# EasyEDA Pro project ProPrj_zmk-afa_2025-04-29.epro

# Schematic Schematic1
Board Name: Board1; Create Date: 2025-04-28; Page Name: P1; Project Name: zmk-afa; Schematic Name: Schematic1; Update Date: 2025-04-28; Company: 嘉立创EDA; Page Size: A4; Version: V1.0
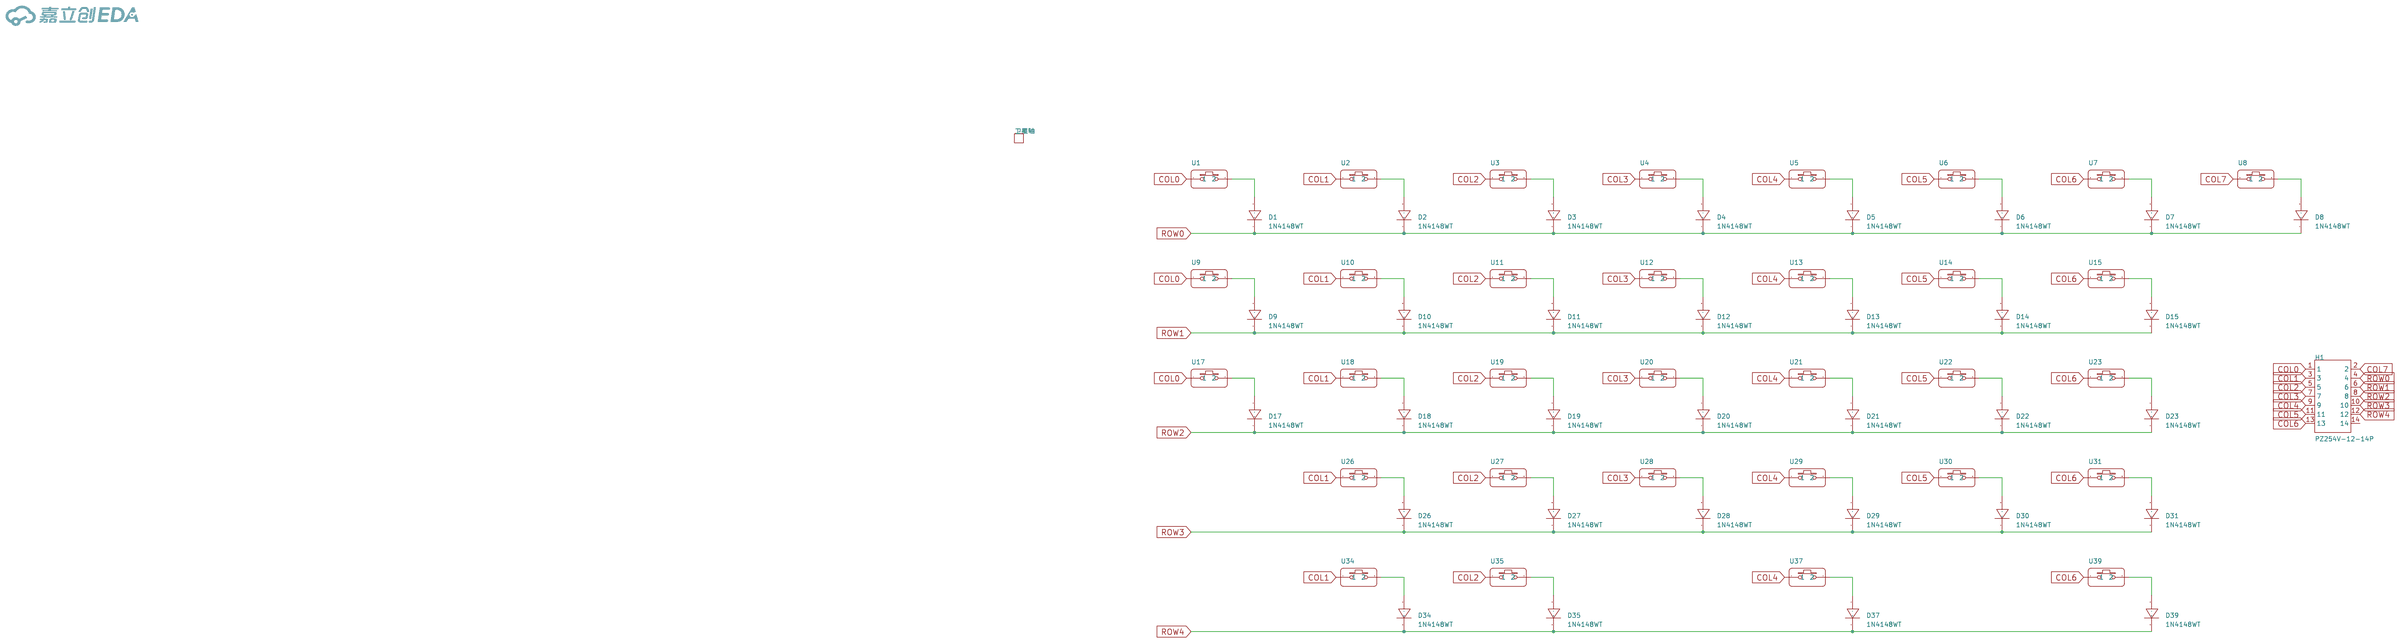
[diagram p0: schematic sheet]

## Parts
D1  1N4148WT  [SOD-123_L2.8-W1.8-LS3.7-RD-3]
D2  1N4148WT  [SOD-123_L2.8-W1.8-LS3.7-RD-3]
D3  1N4148WT  [SOD-123_L2.8-W1.8-LS3.7-RD-3]
D4  1N4148WT  [SOD-123_L2.8-W1.8-LS3.7-RD-3]
D5  1N4148WT  [SOD-123_L2.8-W1.8-LS3.7-RD-3]
D6  1N4148WT  [SOD-123_L2.8-W1.8-LS3.7-RD-3]
D7  1N4148WT  [SOD-123_L2.8-W1.8-LS3.7-RD-3]
D8  1N4148WT  [SOD-123_L2.8-W1.8-LS3.7-RD-3]
D9  1N4148WT  [SOD-123_L2.8-W1.8-LS3.7-RD-3]
D10  1N4148WT  [SOD-123_L2.8-W1.8-LS3.7-RD-3]
D11  1N4148WT  [SOD-123_L2.8-W1.8-LS3.7-RD-3]
D12  1N4148WT  [SOD-123_L2.8-W1.8-LS3.7-RD-3]
D13  1N4148WT  [SOD-123_L2.8-W1.8-LS3.7-RD-3]
D14  1N4148WT  [SOD-123_L2.8-W1.8-LS3.7-RD-3]
D15  1N4148WT  [SOD-123_L2.8-W1.8-LS3.7-RD-3]
D17  1N4148WT  [SOD-123_L2.8-W1.8-LS3.7-RD-3]
D18  1N4148WT  [SOD-123_L2.8-W1.8-LS3.7-RD-3]
D19  1N4148WT  [SOD-123_L2.8-W1.8-LS3.7-RD-3]
D20  1N4148WT  [SOD-123_L2.8-W1.8-LS3.7-RD-3]
D21  1N4148WT  [SOD-123_L2.8-W1.8-LS3.7-RD-3]
D22  1N4148WT  [SOD-123_L2.8-W1.8-LS3.7-RD-3]
D23  1N4148WT  [SOD-123_L2.8-W1.8-LS3.7-RD-3]
D26  1N4148WT  [SOD-123_L2.8-W1.8-LS3.7-RD-3]
D27  1N4148WT  [SOD-123_L2.8-W1.8-LS3.7-RD-3]
D28  1N4148WT  [SOD-123_L2.8-W1.8-LS3.7-RD-3]
D29  1N4148WT  [SOD-123_L2.8-W1.8-LS3.7-RD-3]
D30  1N4148WT  [SOD-123_L2.8-W1.8-LS3.7-RD-3]
D31  1N4148WT  [SOD-123_L2.8-W1.8-LS3.7-RD-3]
D34  1N4148WT  [SOD-123_L2.8-W1.8-LS3.7-RD-3]
D35  1N4148WT  [SOD-123_L2.8-W1.8-LS3.7-RD-3]
D37  1N4148WT  [SOD-123_L2.8-W1.8-LS3.7-RD-3]
D39  1N4148WT  [SOD-123_L2.8-W1.8-LS3.7-RD-3]
H1  PZ254V-12-14P  [HDR-TH_14P-P2.54-V-M-R2-C7-S2.54]
U1  -  [两用轴座无灯]
U2  -  [两用轴座无灯]
U3  -  [两用轴座无灯]
U4  -  [两用轴座无灯]
U5  -  [两用轴座无灯]
U6  -  [两用轴座无灯]
U7  -  [两用轴座无灯]
U8  -  [两用轴座无灯]
U9  -  [两用轴座无灯]
U10  -  [两用轴座无灯]
U11  -  [两用轴座无灯]
U12  -  [两用轴座无灯]
U13  -  [两用轴座无灯]
U14  -  [两用轴座无灯]
U15  -  [两用轴座无灯]
U17  -  [两用轴座无灯]
U18  -  [两用轴座无灯]
U19  -  [两用轴座无灯]
U20  -  [两用轴座无灯]
U21  -  [两用轴座无灯]
U22  -  [两用轴座无灯]
U23  -  [两用轴座无灯]
U26  -  [两用轴座无灯]
U27  -  [两用轴座无灯]
U28  -  [两用轴座无灯]
U29  -  [两用轴座无灯]
U30  -  [两用轴座无灯]
U31  -  [两用轴座无灯]
U34  -  [两用轴座无灯]
U35  -  [两用轴座无灯]
U37  -  [两用轴座无灯]
U39  -  [两用轴座无灯]
卫星轴  -  [卫星轴]

## Library data of the parts
D1-D15 D17-D23 D26-D31 D34 D35 D37 D39 = 1N4148WT_C232841: 二极管配置:独立式;正向压降(Vf):1V@10mA;直流反向耐压(Vr):75V;整流电流:300mA;反向恢复时间(trr):4ns;; LCSC Part Name: 电压:75V 电流:300mA; Supplier Part: C232841; Manufacturer: onsemi(安森美); Supplier Footprint: SOD-523F; JLCPCB Part Class: 扩展库; Datasheet: https://atta.szlcsc.com/upload/public/pdf/source/20181222/C232841_42C5BA49E5A441BB8F6B91D0F4CD0D51.pdf; Supplier: LCSC; Diode Configuration: 独立式; Forward Voltage (Vf@If): 1V@10mA; Reverse Voltage (Vr): 75V; Rectified Current: 300mA; Reverse Leakage Current: 5uA@75V; Reverse Recovery Time (trr): 4ns; Operating Temperature: -55℃~+150℃@(Tj)
H1 = PZ254V-12-14P: 插针结构:2x7P;间距:2.54mm;行距:2.54mm;圆针/方针:方针;安装方式:直插;排数:双排;总PIN位数:14P;额定电流:-;额定电压:-;配合针长度:6mm;塑高:2.5mm;端接针长度:3mm;触头材质:黄铜;触头镀层:-;工作温度:-40℃~+105℃;颜色:黑色;; LCSC Part Name: 2x7P 间距:2.54mm 方针 直插; Supplier Part: C492424; Manufacturer: XFCN(兴飞); Supplier Footprint: 插件,P=2.54mm; JLCPCB Part Class: 扩展库; Datasheet: https://atta.szlcsc.com/upload/public/pdf/source/20200309/C492424_D71F2B7B4151908BA6AE7E1F567EA536.pdf; Supplier: LCSC; Pin Structure: 2x7P; Pitch: 2.54mm; Row Spacing: 2.54mm; Circluar Pins/Square Pins: 方针; Mounting Type: 直插; Number of Rows: 双排; Number of Pins: 14P; Length of Mating Pin: 6mm; Insulation Height: 2.5mm; Length of End Connection Pin: 3mm; Contact Material: 黄铜; Operating Temperature: -40℃~+105℃; Color: 黑色
U1-U15 U17-U23 U26-U31 U34 U35 U37 U39 = 两用轴座无灯
卫星轴 = 卫星轴: _: 3

## Nets
COL0: H1.1 U1.1 U9.1 U17.1
COL1: H1.3 U2.1 U10.1 U18.1 U26.1 U34.1
COL2: H1.5 U3.1 U11.1 U19.1 U27.1 U35.1
COL3: H1.7 U4.1 U12.1 U20.1 U28.1
COL4: H1.9 U5.1 U13.1 U21.1 U29.1 U37.1
COL5: H1.11 U6.1 U14.1 U22.1 U30.1
COL6: H1.13 U7.1 U15.1 U23.1 U31.1 U39.1
COL7: H1.2 U8.1
ROW0: D1.1(C) D2.1(C) D3.1(C) D4.1(C) D5.1(C) D6.1(C) D7.1(C) D8.1(C) H1.4
ROW1: D9.1(C) D10.1(C) D11.1(C) D12.1(C) D13.1(C) D14.1(C) D15.1(C) H1.6
ROW2: D17.1(C) D18.1(C) D19.1(C) D20.1(C) D21.1(C) D22.1(C) D23.1(C) H1.8
ROW3: D26.1(C) D27.1(C) D28.1(C) D29.1(C) D30.1(C) D31.1(C) H1.10
ROW4: D34.1(C) D35.1(C) D37.1(C) D39.1(C) H1.12
$1N4395: D1.2(A) U1.2
$1N4398: D2.2(A) U2.2
$1N4402: D3.2(A) U3.2
$1N4406: D4.2(A) U4.2
$1N4410: D5.2(A) U5.2
$1N4414: D6.2(A) U6.2
$1N4418: D7.2(A) U7.2
$1N4422: D8.2(A) U8.2
$1N4426: D9.2(A) U9.2
$1N4430: D10.2(A) U10.2
$1N4434: D11.2(A) U11.2
$1N4438: D12.2(A) U12.2
$1N4442: D13.2(A) U13.2
$1N4446: D14.2(A) U14.2
$1N4450: D15.2(A) U15.2
$1N4458: D17.2(A) U17.2
$1N4462: D18.2(A) U18.2
$1N4466: D19.2(A) U19.2
$1N4470: D20.2(A) U20.2
$1N4474: D21.2(A) U21.2
$1N4478: D22.2(A) U22.2
$1N4482: D23.2(A) U23.2
$1N4494: D26.2(A) U26.2
$1N4498: D27.2(A) U27.2
$1N4502: D28.2(A) U28.2
$1N4506: D29.2(A) U29.2
$1N4510: D30.2(A) U30.2
$1N4514: D31.2(A) U31.2
$1N4526: D34.2(A) U34.2
$1N4530: D35.2(A) U35.2
$1N4538: D37.2(A) U37.2
$1N4546: D39.2(A) U39.2

Not connected (* = marked no-connect by the designer): H1 14

# Board PCB1
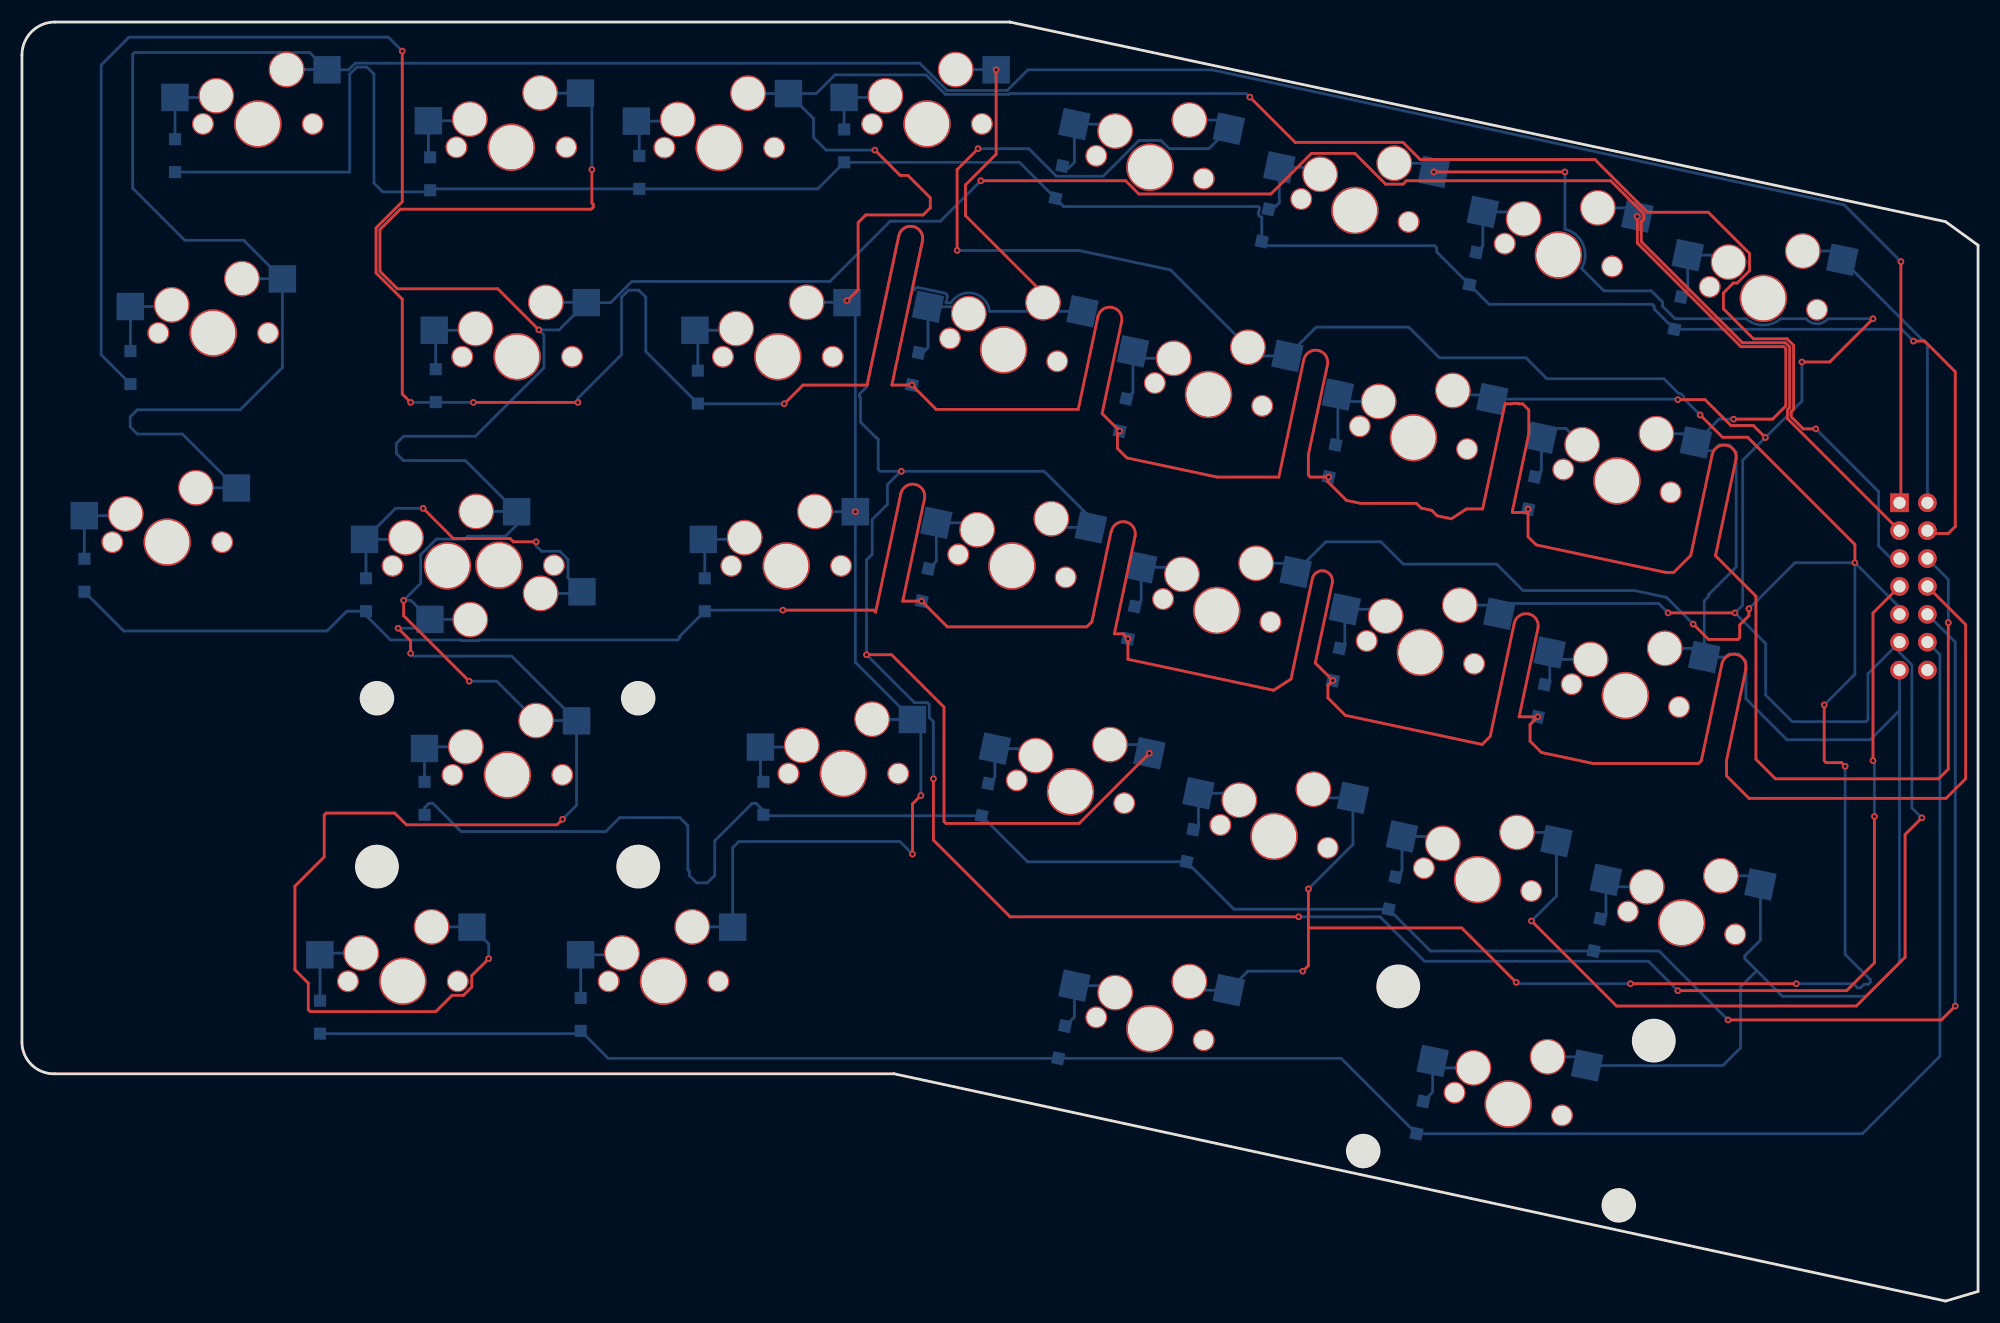
[diagram p1: board, top side]
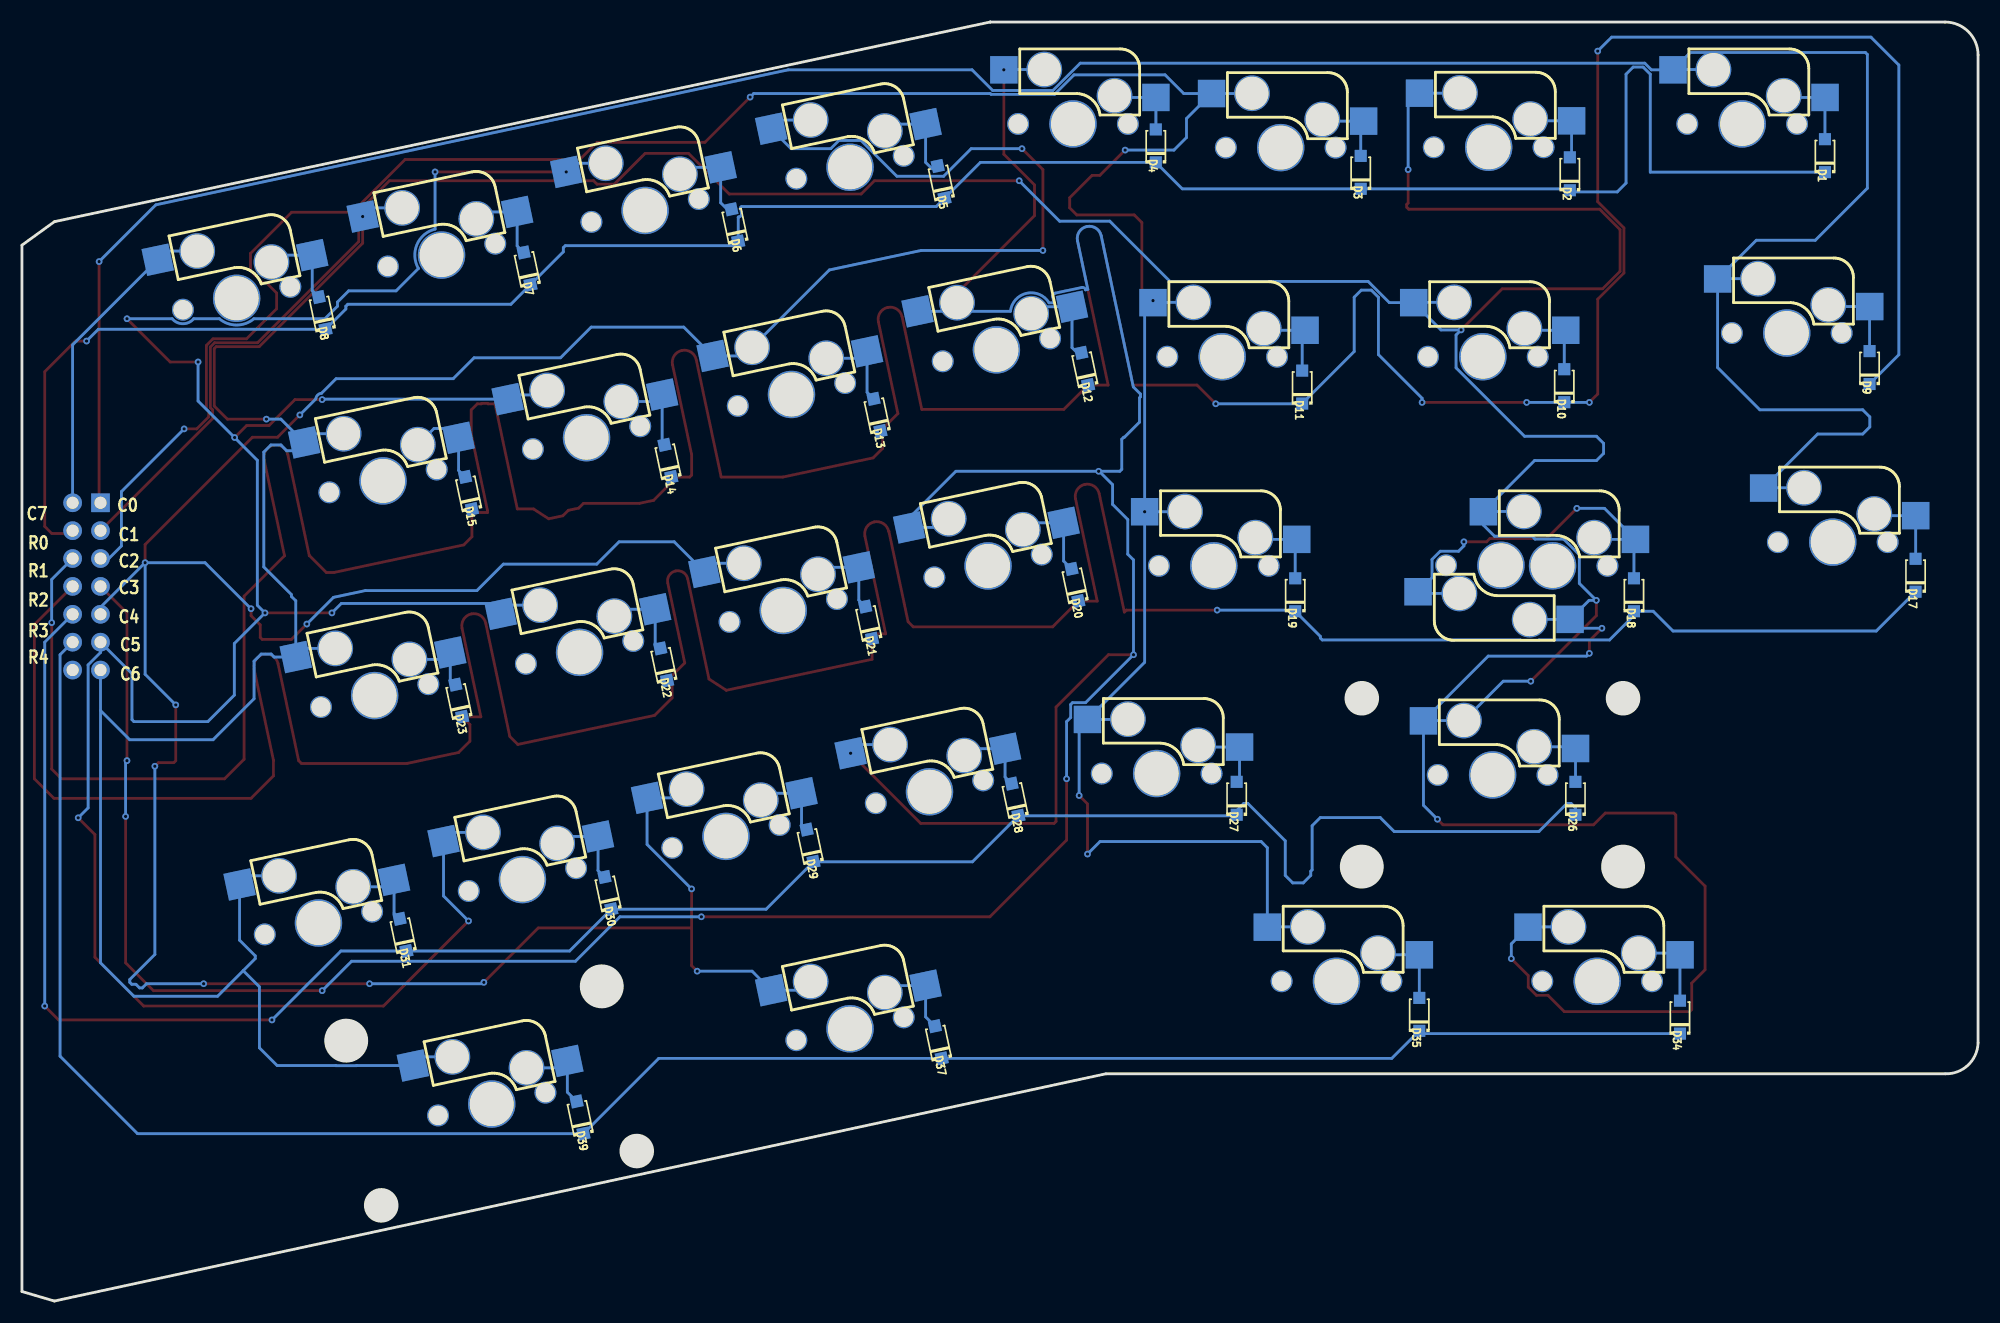
[diagram p2: board, bottom side, seen from below]

Outline 178.2 x 116.53 mm; copper layers: Top Layer, Bottom Layer. Coordinates in mm from the lower left corner of the outline.
Outline path: 89.99,116.52 3,116.52 arc(0.88,115.64) 0,113.52 0,23.52 arc(0.91,21.49) 2.98,20.7 79.45,20.7 175.24,0 178.2,0.87 178.2,96.19 175.24,98.33 89.99,116.52 ; 89.99,116.52 90,116.53
Stack: Top Layer 0.035mm / Dielectric1 1.51mm FR4 er 4.5 / Bottom Layer 0.035mm

## Design rules (mm)
template: JLCPCB Capability(Two Layers Board)
spacing copperThickness1oz (default): track to track 0.102, other pairs 0.152 to 0.3
spacing copperThickness2oz: track to track 0.203, other pairs 0.152 to 0.3
track width copperThickness1oz (default): min 0.127, default 0.254, max 2.54
track width copperThickness2oz: min 0.203, default 0.254, max 2.54
differential pair differentialPair (default): width min 0.127, default 0.254, max 2.54; gap min 0.152, default 0.152
via viaSize (default): diameter min 0.5, default 0.61, max 10; hole min 0.3, default 0.305, max 6.3

## Placement (name value [footprint] x y rotation side)
D1  1N4148WT  [SOD-123_L2.8-W1.8-LS3.7-RD-3]  13.95 104.35 90 bottom
D2  1N4148WT  [SOD-123_L2.8-W1.8-LS3.7-RD-3]  37.19 102.7 90 bottom
D3  1N4148WT  [SOD-123_L2.8-W1.8-LS3.7-RD-3]  56.24 102.82 90 bottom
D4  1N4148WT  [SOD-123_L2.8-W1.8-LS3.7-RD-3]  74.91 105.24 90 bottom
D5  1N4148WT  [SOD-123_L2.8-W1.8-LS3.7-RD-3]  94.46 101.93 78 bottom
D6  1N4148WT  [SOD-123_L2.8-W1.8-LS3.7-RD-3]  113.26 98 78 bottom
D7  1N4148WT  [SOD-123_L2.8-W1.8-LS3.7-RD-3]  132.18 94.06 78 bottom
D8  1N4148WT  [SOD-123_L2.8-W1.8-LS3.7-RD-3]  150.85 90 78 bottom
D9  1N4148WT  [SOD-123_L2.8-W1.8-LS3.7-RD-3]  9.88 85.04 90 bottom
D10  1N4148WT  [SOD-123_L2.8-W1.8-LS3.7-RD-3]  37.69 83.39 90 bottom
D11  1N4148WT  [SOD-123_L2.8-W1.8-LS3.7-RD-3]  61.57 83.27 90 bottom
D12  1N4148WT  [SOD-123_L2.8-W1.8-LS3.7-RD-3]  81.38 84.92 78 bottom
D13  1N4148WT  [SOD-123_L2.8-W1.8-LS3.7-RD-3]  100.31 80.73 78 bottom
D14  1N4148WT  [SOD-123_L2.8-W1.8-LS3.7-RD-3]  119.36 76.53 78 bottom
D15  1N4148WT  [SOD-123_L2.8-W1.8-LS3.7-RD-3]  137.52 73.61 78 bottom
D17  1N4148WT  [SOD-123_L2.8-W1.8-LS3.7-RD-3]  5.69 66.12 90 bottom
D18  1N4148WT  [SOD-123_L2.8-W1.8-LS3.7-RD-3]  31.34 64.34 90 bottom
D19  1N4148WT  [SOD-123_L2.8-W1.8-LS3.7-RD-3]  62.21 64.34 90 bottom
D20  1N4148WT  [SOD-123_L2.8-W1.8-LS3.7-RD-3]  82.27 65.23 78 bottom
D21  1N4148WT  [SOD-123_L2.8-W1.8-LS3.7-RD-3]  101.07 61.8 78 bottom
D22  1N4148WT  [SOD-123_L2.8-W1.8-LS3.7-RD-3]  119.74 57.99 78 bottom
D23  1N4148WT  [SOD-123_L2.8-W1.8-LS3.7-RD-3]  138.41 54.69 78 bottom
D26  1N4148WT  [SOD-123_L2.8-W1.8-LS3.7-RD-3]  36.68 45.8 90 bottom
D27  1N4148WT  [SOD-123_L2.8-W1.8-LS3.7-RD-3]  67.54 45.8 90 bottom
D28  1N4148WT  [SOD-123_L2.8-W1.8-LS3.7-RD-3]  87.73 45.67 78 bottom
D29  1N4148WT  [SOD-123_L2.8-W1.8-LS3.7-RD-3]  106.4 41.48 78 bottom
D30  1N4148WT  [SOD-123_L2.8-W1.8-LS3.7-RD-3]  124.82 37.16 78 bottom
D31  1N4148WT  [SOD-123_L2.8-W1.8-LS3.7-RD-3]  143.49 33.35 78 bottom
D34  1N4148WT  [SOD-123_L2.8-W1.8-LS3.7-RD-3]  27.15 25.86 90 bottom
D35  1N4148WT  [SOD-123_L2.8-W1.8-LS3.7-RD-3]  50.9 26.12 90 bottom
D37  1N4148WT  [SOD-123_L2.8-W1.8-LS3.7-RD-3]  94.72 23.58 78 bottom
D39  1N4148WT  [SOD-123_L2.8-W1.8-LS3.7-RD-3]  127.36 16.72 78 bottom
H1  PZ254V-12-14P  [HDR-TH_14P-P2.54-V-M-R2-C7-S2.54]  172.31 65.1 270 top
U1  -  [两用轴座无灯]  21.44 107.27 0 top
U2  -  [两用轴座无灯]  44.53 105.14 0 top
U3  -  [两用轴座无灯]  63.48 105.11 0 top
U4  -  [两用轴座无灯]  82.4 107.27 0 top
U5  -  [两用轴座无灯]  102.72 103.33 348 top
U6  -  [两用轴座无灯]  121.39 99.39 348 top
U7  -  [两用轴座无灯]  139.93 95.33 348 top
U8  -  [两用轴座无灯]  158.6 91.39 348 top
U9  -  [两用轴座无灯]  17.38 88.22 0 top
U10  -  [两用轴座无灯]  45.06 86.06 0 top
U11  -  [两用轴座无灯]  68.81 86.06 0 top
U12  -  [两用轴座无灯]  89.38 86.69 348 top
U13  -  [两用轴座无灯]  108.05 82.63 348 top
U14  -  [两用轴座无灯]  126.72 78.69 348 top
U15  -  [两用轴座无灯]  145.26 74.76 348 top
U17  -  [两用轴座无灯]  13.18 69.17 0 top
U18  -  [两用轴座无灯]  38.71 67.01 0 top
U18#2  -  [两用轴座无灯]  43.51 67 180 top
U19  -  [两用轴座无灯]  69.57 67.01 0 top
U20  -  [两用轴座无灯]  90.15 67.01 348 top
U21  -  [两用轴座无灯]  108.8 62.95 348 top
U22  -  [两用轴座无灯]  127.36 59.14 348 top
U23  -  [两用轴座无灯]  146.03 55.2 348 top
U26  -  [两用轴座无灯]  44.17 47.96 0 top
U27  -  [两用轴座无灯]  74.78 48.09 0 top
U28  -  [两用轴座无灯]  95.48 46.44 348 top
U29  -  [两用轴座无灯]  114.02 42.37 348 top
U30  -  [两用轴座无灯]  132.56 38.43 348 top
U31  -  [两用轴座无灯]  151.14 34.48 348 top
U34  -  [两用轴座无灯]  34.65 29.16 0 top
U35  -  [两用轴座无灯]  58.4 29.16 0 top
U37  -  [两用轴座无灯]  102.72 24.84 348 top
U39  -  [两用轴座无灯]  135.36 17.99 348 top
卫星轴  -  [卫星轴]  44.81 47.96 0 top
卫星轴#2  -  [卫星轴]  134.72 18.11 168 top

## Footprints (pads in the part's own frame, mm; a bottom-side part is the same pattern mirrored in y, then rotated)
HDR-TH_14P-P2.54-V-M-R2-C7-S2.54
  rect 1.7x1.7 hole 1.1: 1(-7.62,-1.27)
  round 1.7 hole 1.1: 2(-7.62,1.27) 3(-5.08,-1.27) 4(-5.08,1.27) 5(-2.54,-1.27) 6(-2.54,1.27) 7(0,-1.27) 8(0,1.27) 9(2.54,-1.27) 10(2.54,1.27) 11(5.08,-1.27) 12(5.08,1.27) 13(7.62,-1.27) 14(7.62,1.27)
SOD-123_L2.8-W1.8-LS3.7-RD-3
  rect 1.1x1.1 smd: 1(-1.5,0) 2(1.5,0)
两用轴座无灯
  round 3.251 hole 3: 1(2.667,4.923) 2(-3.733,2.535)
  rect 2.5x2.5 smd far side: 1(6.351,4.898) 2(-7.502,2.381)
  round 4.318 hole 4: 3(0.051,-0.029)
  round 2 hole 1.75: 4(-4.949,-0.03) 5(5.051,-0.03)

## Nets
As in the schematic, except:
COL1: H1.3 U2.1 U10.1 U18.1 U18#2.1 U26.1 U34.1
$1N4462: D18.2 U18.2 U18#2.2

Pads without a net: H1 14; U1 3 4 5; U2 3 4 5; U3 3 4 5; U4 3 4 5; U5 3 4 5; U6 3 4 5; U7 3 4 5; U8 3 4 5; U9 3 4 5; U10 3 4 5; U11 3 4 5; U12 3 4 5; U13 3 4 5; U14 3 4 5; U15 3 4 5; U17 3 4 5; U18 3 4 5; U18#2 3 4 5; U19 3 4 5; U20 3 4 5; U21 3 4 5; U22 3 4 5; U23 3 4 5; U26 3 4 5; U27 3 4 5; U28 3 4 5; U29 3 4 5; U30 3 4 5; U31 3 4 5; U34 3 4 5; U35 3 4 5; U37 3 4 5; U39 3 4 5

## Via types
v1: diameter 0.61, hole 0.305, Top Layer to Bottom Layer, 71 vias

## Routing (per net, layer and track width the routed paths; a pad name or vN(x,y) marks a point on that pad's centre or on a via; arc(x,y) is an arc through that point)
COL0: length 266.2
  Top Layer w0.254: H1.1 171.17,72.85 v1(171.17,94.7)
  Bottom Layer w0.254: v1(171.17,94.7) 166,99.87 108.39,112.17 91.64,112.17 89.77,110.29 84.28,110.29 81.79,112.77 30.36,112.77 29.75,112.17 U1.1 ; U17.1 19.51,74.09 ; 19.51,74.09 U17.1 ; 19.51,74.09 14.61,78.99 10.51,78.99 9.86,79.63 9.86,80.55 10.51,81.19 19.88,81.19 23.72,85.04 ; 23.73,85.04 U9.1 ; U9.1 23.7,93.14 20.2,96.64 14.83,96.64 10.08,101.38 10.08,113.57 10.26,113.75 26.21,113.75 27.76,112.19 U1.1
COL1: length 393.6
  Top Layer w0.254: v1(35.41,59.01) 35.41,60.15 v1(34.27,61.29) ; v1(87.35,102.06) 100.55,102.06 101.75,100.85 113.77,100.85 117.47,104.56 121.43,104.56 124.23,101.75 125.81,101.75 126.12,102.06 144.73,102.06 147.74,99.04 147.74,98.56 147.52,98.33 147.52,96.52 156.74,87.3 160.65,87.3 161.04,86.92 161.04,81.39 160.83,81.18 160.83,80.4 H1.3 ; v1(47.09,88.47) 43.35,92.22 34.2,92.22 32.61,93.81 32.61,97.62 34.47,99.47 51.87,99.47 52.05,99.65 52.05,99.9 51.92,100.03 v1(51.92,103.08) ; v1(34.77,63.83) 34.77,62.44 v1(40.74,56.47) ; v1(42.52,31.2) 40.98,29.65 40.98,28.6 40.23,27.85 39.18,27.85 37.7,26.37 26.27,26.37 26.09,26.55 26.09,28.96 24.87,30.18 24.87,37.8 27.53,40.47 27.53,44.28 27.71,44.46 33.96,44.46 35.03,43.39 48.74,43.39 v1(49.25,43.9)
  Bottom Layer w0.254: v1(87.35,102.06) 83.67,98.38 79.1,98.38 73.61,92.89 55.56,92.89 53.63,90.96 U10.1 ; U18.1 45.06,70.69 44.05,69.68 40.62,69.68 40.36,69.42 37.75,69.42 36.32,67.99 36.32,65.38 v1(34.77,63.83) 35.43,63.83 U18#2.1 ; U18#2.1 40.82,62.1 U18#2.1 ; U2.1 47.22,110.04 U2.1 51.92,109 v1(51.92,103.08) ; U18#2.1 36.36,61.29 v1(34.27,61.29) ; v1(35.41,59.01) 35.66,58.75 44.63,58.75 50.5,52.88 U26.1 43.25,56.47 v1(40.74,56.47) ; U10.1 51.39,90.98 U10.1 ; U10.1 48.93,88.47 v1(47.09,88.47) 47.55,88.01 47.55,85.02 41.31,78.78 34.76,78.78 34.11,78.13 34.11,77.22 34.76,76.57 40.4,76.57 45.04,71.93 U18.1 ; v1(49.25,43.9) 50.52,45.17 U26.1 ; v1(42.52,31.2) 42.52,32.54 U34.1 40.97,34.09 U34.1
COL2: length 263.4
  Top Layer w0.254: v1(75.16,91.14) 76.18,92.16 76.18,98.25 76.87,98.95 82.11,98.95 82.75,99.59 82.75,100.51 80.71,102.55 80,102.55 v1(77.7,104.86) ; v1(81.89,46.05) 81.13,45.29 v1(81.13,40.72) ; v1(111.86,109.68) 115.98,105.56 125.81,105.56 127.37,104 143.3,104 148.1,99.19 153.63,99.19 157.38,95.44 157.38,93.86 156.26,92.75 155.91,92.75 155,91.83 155,90.4 157.74,87.66 160.8,87.66 161.4,87.06 161.4,81.24 161.19,81.04 161.19,80.55 162.28,79.46 v1(163.43,79.46)
  Bottom Layer w0.254: U11.1 75.14,90.98 U11.1 75.92,90.2 v1(75.92,71.91) ; v1(163.43,79.46) 169.14,73.74 169.14,68.79 170.28,67.64 H1.5 ; 69.83,110.01 66.17,110.01 U3.1 ; 69.83,110.01 72.36,110.01 74.06,111.71 82.35,111.71 84.13,109.93 89.91,109.93 89.99,110.01 111.54,110.01 v1(111.86,109.68) ; 69.83,110.01 72.11,107.72 72.11,106 73.26,104.86 v1(77.7,104.86) ; v1(75.92,71.91) 75.92,58.19 U27.1 ; v1(75.92,71.91) 72.27,71.91 U19.1 ; U35.1 64.72,34.09 U35.1 64.75,41.3 65.31,41.86 79.99,41.86 v1(81.13,40.72) ; U27.1 77.47,52.98 U27.1 ; v1(81.89,46.05) 81.89,52.22 U27.1
COL3: length 314.1
  Top Layer w0.254: v1(168.63,49.23) 168.63,62.69 H1.7 ; v1(83.03,47.58) 83.03,41.99 90.02,35.01 v1(116.31,35.01) ; v1(76.94,58.88) 79.22,58.88 84,54.11 84,43.69 84.18,43.51 96.32,43.51 v1(102.71,49.91) ; v1(88.75,112.17) 88.75,104.47 85.95,101.68 85.95,98.89 93.02,91.82 93.02,90.96 ; v1(168.76,44.15) 168.76,30.81 166.22,28.27 v1(150.85,28.27)
  Bottom Layer w0.254: v1(168.63,49.23) 168.76,49.1 v1(168.76,44.15) ; U20.1 94.57,70.48 U20.1 97.38,71.34 93.12,75.59 v1(80.11,75.59) 80.06,75.59 ; v1(150.85,28.27) 148.17,30.96 127.78,30.96 123.73,35.01 v1(116.31,35.01) ; 99.11,50.7 101.92,50.7 v1(102.71,49.91) ; U4.1 88.72,112.19 v1(88.75,112.17) ; 80.06,75.59 78.84,74.38 78.84,72.58 77.46,71.2 77.46,68.04 76.94,67.52 v1(76.94,58.88) 81.31,54.51 82.49,54.51 82.66,54.35 82.66,53.16 83.03,52.79 v1(83.03,47.58) ; 80.06,75.59 78.19,75.59 78.01,75.77 78.01,78.51 77.83,78.69 77.77,78.69 76.39,80.07 76.39,82.29 76.3,82.38 76.3,82.63 76.96,83.28 79.88,97.04 arc(80.36,97.74) 81.19,97.89 arc(81.89,97.41) 82.04,96.58 81.1,92.17 81.31,92.12 arc(81.43,92.3) 81.64,92.34 84.08,91.82 arc(84.26,91.7) 84.3,91.49 84.18,90.94 84.63,90.94 arc(86.67,91.81) 88.15,90.16 U12.1
COL4: length 334.9
  Top Layer w0.254: v1(152.88,80.73) 154.92,78.69 157.2,78.69 166.98,68.91 v1(166.98,67.26) ; v1(85.19,95.71) 85.19,103.08 v1(87.1,104.98) ; v1(117.2,37.55) 117.2,33.97 ; 117.2,33.97 117.21,33.99 131.17,33.99 v1(136.12,29.04) ; 117.2,33.97 117.2,30.56 v1(116.69,30.05) ; v1(152.25,61.68) 153.65,60.28 156.31,60.28 156.49,60.46 156.49,61.6 157.33,62.44 v1(157.33,63.07) ; v1(166.09,48.72) 165.76,49.05 164.37,49.05 164.19,49.23 v1(164.19,54.31) ; v1(161.65,28.91) v1(146.53,28.91)
  Bottom Layer w0.254: v1(87.1,104.98) 91.72,104.98 94.24,102.47 98.49,102.47 101.75,105.73 103.77,105.73 104.52,104.98 108.13,104.98 U5.1 109.16,107.59 U5.1 ; U29.1 118.45,45.84 U29.1 121.25,41.6 v1(117.2,37.55) ; v1(161.65,28.91) 166.85,28.91 167.24,28.53 167.49,28.53 167.82,28.86 168.2,28.86 168.38,29.04 168.38,29.29 166.09,31.58 v1(166.09,48.72) ; v1(152.88,80.73) 151.43,82.18 arc(151.26,82.53) 150.91,82.7 149.58,84.03 138.91,84.03 137.01,85.93 129.13,85.93 126.34,88.73 117.91,88.73 115.28,86.1 112.48,86.1 104.64,93.93 96.28,95.71 v1(85.19,95.71) ; v1(164.19,54.31) 166.98,57.1 v1(166.98,67.26) ; U37.1 107.14,28.32 U37.1 111.69,30.05 v1(116.69,30.05) ; v1(166.98,67.26) 171.05,63.2 H1.9 ; v1(166.98,67.26) 161.52,67.26 v1(157.33,63.07) ; 112.44,67.21 115.24,67.21 U21.1 118.78,69.17 123.8,69.17 125.83,67.14 134.34,67.14 136.75,64.72 146.91,64.72 149.82,64.11 v1(152.25,61.68) ; v1(146.53,28.91) 136.25,28.91 v1(136.12,29.04)
COL5: length 253.2
  Top Layer w0.254: v1(150.85,82.12) 153.33,82.12 155.69,79.76 157.73,79.76 v1(158.83,78.67) ; v1(149.96,62.69) v1(156.06,62.69) ; v1(162.15,85.55) 164.69,85.55 v1(168.63,89.49) ; v1(137.52,34.62) 145.26,26.88 167.11,26.88 171.55,31.32 171.55,42.5 v1(173.08,44.02) ; v1(128.62,102.86) v1(140.56,102.86)
  Bottom Layer w0.254: 130.36,82.55 133.57,82.55 U14.1 150.81,82.16 v1(150.85,82.12) ; v1(149.96,62.69) 149.11,63.55 135.53,63.55 134.59,62.61 133.8,63.4 U22.1 ; v1(173.08,44.02) 172.17,44.93 172.17,57.95 171.05,59.08 H1.11 168.18,57.16 168.18,52.96 168,52.79 161.27,52.79 158.85,55.2 158.85,59.9 v1(156.06,62.69) 156.76,63.39 156.76,76.6 v1(158.83,78.67) 162.15,82 v1(162.15,85.55) ; v1(168.63,89.49) 164.51,89.49 arc(163.53,89.03) 162.56,89.49 160.21,89.49 arc(158.64,88.92) 157.07,89.49 150.6,89.49 149.45,90.63 149.45,91.01 148.44,92.03 144.12,92.03 142.08,94.07 arc(142.22,96.24) 140.56,97.66 v1(140.56,102.86) ; v1(137.52,34.62) 139.79,36.9 U30.1 139,42.7 136.2,42.7 ; 125.02,103.66 127.83,103.66 v1(128.62,102.86)
COL6: length 176
  Top Layer w0.254: v1(147.16,98.8) 147.16,96.38 156.59,86.95 160.5,86.95 160.68,86.77 160.68,81.54 159.49,80.34 v1(155.93,80.34)
  Bottom Layer w0.254: U31.1 157.58,38.74 158.38,37.95 158.38,32.88 156.95,31.45 156.95,31.2 158.04,30.1 ; 158.04,30.1 156.57,28.63 156.57,23.07 154.96,21.46 149.62,21.46 149.6,21.44 147.72,21.44 147.7,21.46 U39.1 141.8,22.25 U39.1 ; 158.04,30.1 160.38,27.77 168,27.77 171.05,30.81 171.05,53.8 ; U15.1 151.7,79.02 148.9,79.02 ; U15.1 153.26,77.46 154.08,77.46 154.61,77.99 155.52,77.99 156.17,77.34 156.17,66.87 153.66,64.36 153.66,64.2 153.26,63.8 U23.1 ; U15.1 154.61,80.34 v1(155.93,80.34) ; v1(147.16,98.8) 146.37,99.59 143.56,99.59 ; 149.66,59.46 152.47,59.46 U23.1 ; U23.1 155.22,58.67 155.49,58.94 156.41,58.94 157.06,58.29 157.06,54.87 160.79,51.13 168.38,51.13 171.05,53.8 ; 171.05,53.8 H1.13
COL7: length 29.3
  Bottom Layer w0.254: U8.1 165.04,95.65 U8.1 173.58,87.11 H1.2
ROW0: length 210.1
  Top Layer w0.254: v1(172.31,87.46) 173.33,87.46 176.12,84.66 176.12,70.57 175.49,69.93 173.84,69.93 H1.4
  Bottom Layer w0.254: D1.1 29.86,102.85 29.86,111.77 30.51,112.42 31.42,112.42 32.07,111.77 32.07,101.85 32.87,101.05 37.04,101.05 D2.1 37.31,101.32 D3.1 72.49,101.32 D4.1 90.88,103.74 D5.1 94.91,99.71 112.64,99.71 112.75,99.6 112.65,99.1 arc(112.69,98.89) 112.86,98.77 112.95,98.75 D6.1 113.33,96.14 128.7,96.14 128.88,95.97 128.88,95.58 131.87,92.59 133.65,90.81 148.51,90.81 148.69,90.63 148.69,90.38 150.54,88.53 171.24,88.53 v1(172.31,87.46)
ROW1: length 403.8
  Top Layer w0.254: 137.2,72.02 137.18,72.02 137,71.84 135.79,71.84 135.79,72.02 137.27,78.99 137.27,81.18 136.72,81.74 136.35,81.74 136.31,81.78 135.78,81.78 135.74,81.74 135.14,81.74 135.11,81.76 133.07,72.16 131.6,72.16 130.21,71.26 128.92,71.54 128.43,72.04 127.48,72.24 127.04,72.67 121.95,72.67 120.66,72.95 118.97,74.63 118.97,74.99 v1(119.04,75.07) 117.37,75.07 117.19,75.25 117.19,77.11 118.93,85.29 arc(118.78,86.12) 118.08,86.6 arc(117.25,86.45) 116.77,85.75 114.5,75.07 108.87,75.07 100.66,76.81 99.8,77.68 99.8,79.06 v1(99.99,79.26) 98.4,80.85 100.18,89.21 arc(100.03,90.04) 99.33,90.52 arc(98.5,90.37) 98.02,89.67 96.23,81.23 83.29,81.23 v1(81.07,83.45) 79.25,83.45 82.04,96.58 arc(81.89,97.41) 81.19,97.89 arc(80.36,97.74) 79.88,97.04 76.99,83.45 71.15,83.45 v1(69.45,81.74) ; 137.2,72.02 137.2,69.63 137.95,68.89 149.77,66.37 150.47,66.37 152,67.9 152.02,67.9 153.98,77.12 arc(154.46,77.81) 155.29,77.97 arc(155.99,77.49) 156.14,76.66 154.28,67.9 157.96,64.22 157.96,49.36 159.74,47.58 174.6,47.58 175.49,48.47 v1(175.49,61.8) ; 137.2,72.02 v1(137.2,72.15) ; v1(34.65,113.87) 34.65,100.15 32.26,97.76 32.26,93.66 34.65,91.27 34.65,82.63 v1(35.41,81.87) ; v1(50.65,81.87) v1(41.12,81.87)
  Bottom Layer w0.254: v1(35.41,81.87) 37.67,81.87 D10.1 37.72,81.87 v1(41.12,81.87) ; v1(50.65,81.87) 50.65,82.25 54.62,86.23 54.62,91.45 55.27,92.1 56.19,92.1 56.83,91.45 56.83,86.5 D11.1 61.59,81.74 v1(69.45,81.74) ; v1(175.49,61.8) 175.49,65.74 H1.6 ; D9.1 7.22,86.21 7.22,112.6 9.75,115.14 33.38,115.14 v1(34.65,113.87)
ROW2: length 306.5
  Top Layer w0.254: v1(69.32,62.95) 77.59,62.95 77.77,62.76 80.06,73.55 arc(80.54,74.24) 81.37,74.4 arc(82.07,73.92) 82.22,73.09 80.24,63.76 v1(81.96,63.76) 84.3,61.42 97,61.42 97.47,61.89 99.22,70.11 99.25,70.13 arc(99.72,70.83) 100.55,70.98 arc(101.25,70.5) 101.41,69.67 99.52,60.79 100.3,60.79 v1(100.76,60.34) 100.76,58.46 114.03,55.64 115.61,56.67 117.55,65.8 arc(117.95,66.38) 118.65,66.51 arc(119.24,66.11) 119.37,65.41 117.82,58.13 v1(119.42,56.53) 118.98,56.08 118.98,54.94 120.56,53.35 133.02,50.71 133.76,51.44 135.95,61.75 arc(136.43,62.44) 137.26,62.6 arc(137.95,62.12) 138.11,61.29 136.39,53.22 v1(138.09,53.22) 137.39,52.52 137.39,51.01 138.42,49.97 143.12,48.98 152.74,48.98 152.99,49.23 154.87,58.07 arc(155.07,58.51) 155.45,58.82 arc(155.8,58.93) 156.18,58.92 arc(156.88,58.44) 157.03,57.61 157.05,57.57 155.29,49.26 155.29,47.84 157.33,45.8 175.29,45.8 177.07,47.58 177.07,61.62 H1.8
  Bottom Layer w0.254: 30.96,62.84 33.57,60.23 40,60.23 40.06,60.17 41.64,60.17 41.69,60.23 59.74,60.23 59.92,60.41 59.92,60.56 D19.1 62.31,62.95 v1(69.32,62.95) ; 30.96,62.84 29.59,62.84 27.79,61.04 9.27,61.04 D17.1 ; 30.96,62.84 D18.1
ROW3: length 197.4
  Top Layer w0.254: v1(176.12,26.88) 174.86,25.61 v1(155.42,25.61)
  Bottom Layer w0.254: H1.10 176.12,60.02 v1(176.12,26.88) ; v1(155.42,25.61) 149.14,31.89 D31.1 128.31,31.89 124.51,35.7 110.41,35.7 D29.1 91.61,40.02 D28.1 67.63,44.21 D27.1 67.54,44.68 66.88,45.34 66.52,45.34 63.11,41.93 63.11,38.77 62.43,38.09 61.47,38.09 60.79,38.77 60.79,39.16 60.66,39.28 60.66,43.3 59.92,44.04 54.46,44.04 53.19,42.77 40,42.77 37.44,45.34 37.08,45.34 36.68,44.94 D26.1
ROW4: length 192.7
  Bottom Layer w0.254: D34.1 50.65,24.36 D35.1 53.41,22.11 D37.1 120.19,22.11 D39.1 167.67,15.25 174.73,22.31 174.73,58.88 H1.12
$1N4395: length 7.6
  Bottom Layer w0.254: U1.2 17.55,109.65 U1.2 13.95,109.64 D1.2
$1N4398: length 7.2
  Bottom Layer w0.254: U2.2 40.64,107.52 U2.2 37.03,104.35 D2.2
$1N4402: length 7.1
  Bottom Layer w0.254: D3.2 56.24,107.23 U3.2 59.59,107.49 U3.2
$1N4406: length 6.7
  Bottom Layer w0.254: D4.2 74.9,106.74 74.9,109.65 78.51,109.65 U4.2
$1N4410: length 8.3
  Bottom Layer w0.254: U5.2 98.96,107.22 U5.2 95.88,103.74 95.28,103.15
$1N4414: length 8
  Bottom Layer w0.254: 113.95,99.46 114.55,100.06 114.55,103.28 117.63,103.28 U6.2
$1N4418: length 7.9
  Bottom Layer w0.254: 132.49,95.53 133.09,96.12 133.09,99.22 136.17,99.22 U7.2
$1N4422: length 7.4
  Bottom Layer w0.254: 151.62,91.92 151.76,92.06 U8.2 154.84,95.28 U8.2
$1N4426: length 7.9
  Bottom Layer w0.254: U9.2 13.49,90.6 U9.2 9.88,90.59 D9.2
$1N4430: length 7.4
  Bottom Layer w0.254: U10.2 41.17,88.44 U10.2 37.69,88.3 D10.2
$1N4434: length 7.6
  Bottom Layer w0.254: U11.2 64.92,88.44 U11.2 61.57,88.18 D11.2
$1N4438: length 8.4
  Bottom Layer w0.254: 82.06,86.38 82.54,86.86 82.54,90.58 85.63,90.58 U12.2
$1N4442: length 8.6
  Bottom Layer w0.254: U13.2 101.84,85.89 101.21,86.52 101.21,82.78 D13.2
$1N4446: length 8.6
  Bottom Layer w0.254: 119.88,82.58 119.88,82.55 ; 119.88,82.55 120.48,81.95 U14.2 ; 119.88,82.55 119.88,78.21 D14.2
$1N4450: length 7.3
  Bottom Layer w0.254: U15.2 140.66,79.5 139.27,79.5 ; D15.2 138.42,75.67 U15.2
$1N4458: length 7.8
  Bottom Layer w0.254: D17.2 5.68,67.63 U17.2 9.3,71.55 U17.2
$1N4462: length 36.6
  Top Layer w0.254: v1(46.84,69.17) 44.77,69.17 44.47,69.47 39.3,69.47 v1(36.55,72.22)
  Bottom Layer w0.254: v1(36.55,72.22) 34.03,72.22 U18.2 ; D18.2 31.34,69.25 U18.2 ; U18.2 34.82,69.39 U18.2 ; v1(46.84,69.17) 46.84,68.8 47.33,68.31 48.99,68.31 49.74,67.56 49.74,65.89 U18#2.2 50.86,64.46 U18#2.2
$1N4466: length 7.4
  Bottom Layer w0.254: U19.2 65.68,69.39 U19.2 62.21,69.25 D19.2
$1N4470: length 8.5
  Bottom Layer w0.254: D20.2 83.3,67.42 83.3,70.9 86.39,70.9 U20.2
$1N4474: length 7.8
  Bottom Layer w0.254: D21.2 101.96,63.85 U21.2 105.05,66.84 U21.2
$1N4478: length 7.7
  Bottom Layer w0.254: U22.2 123.6,63.02 U22.2 120.51,59.92 120.05,59.46
$1N4482: length 7.1
  Bottom Layer w0.254: D23.2 139.18,56.62 139.18,59.09 139.82,58.45 U23.2
$1N4494: length 6.9
  Bottom Layer w0.254: U26.2 36.82,50.49 U26.2 36.67,47.31 D26.2
$1N4498: length 7.1
  Bottom Layer w0.254: U27.2 70.89,50.47 U27.2 67.28,47.56 D27.2
$1N4502: length 7.4
  Bottom Layer w0.254: U28.2 91.72,50.32 U28.2 88.64,47.73 D28.2
$1N4506: length 7.5
  Bottom Layer w0.254: U29.2 110.27,46.26 107.18,46.26 107.18,43.41 D29.2
$1N4510: length 7.9
  Bottom Layer w0.254: 125.13,38.63 125.72,39.22 125.72,42.32 128.81,42.32 U30.2
$1N4514: length 7.7
  Bottom Layer w0.254: U31.2 144.94,37.74 U31.2 144.3,35.33 D31.2
$1N4526: length 8
  Bottom Layer w0.254: U34.2 27.3,31.7 U34.2 27.15,31.54 D34.2
$1N4530: length 7.8
  Bottom Layer w0.254: D35.2 50.9,31.54 U35.2 54.51,31.54 U35.2
$1N4538: length 8
  Bottom Layer w0.254: D37.2 95.88,25.89 U37.2 98.96,28.73 U37.2
$1N4546: length 8
  Bottom Layer w0.254: U39.2 129.15,21.24 128.51,21.88 128.51,19.03 D39.2

## Text on the board
Bottom Silkscreen Layer: C5 | C6 | C1 | C2 | C3 | C4 | C0 | R0 | R1 | R2 | R3 | R4 | C7
